# EAGLE design Adapter Light (EAGLE 9.6.1)

## Sheet 1 of 2
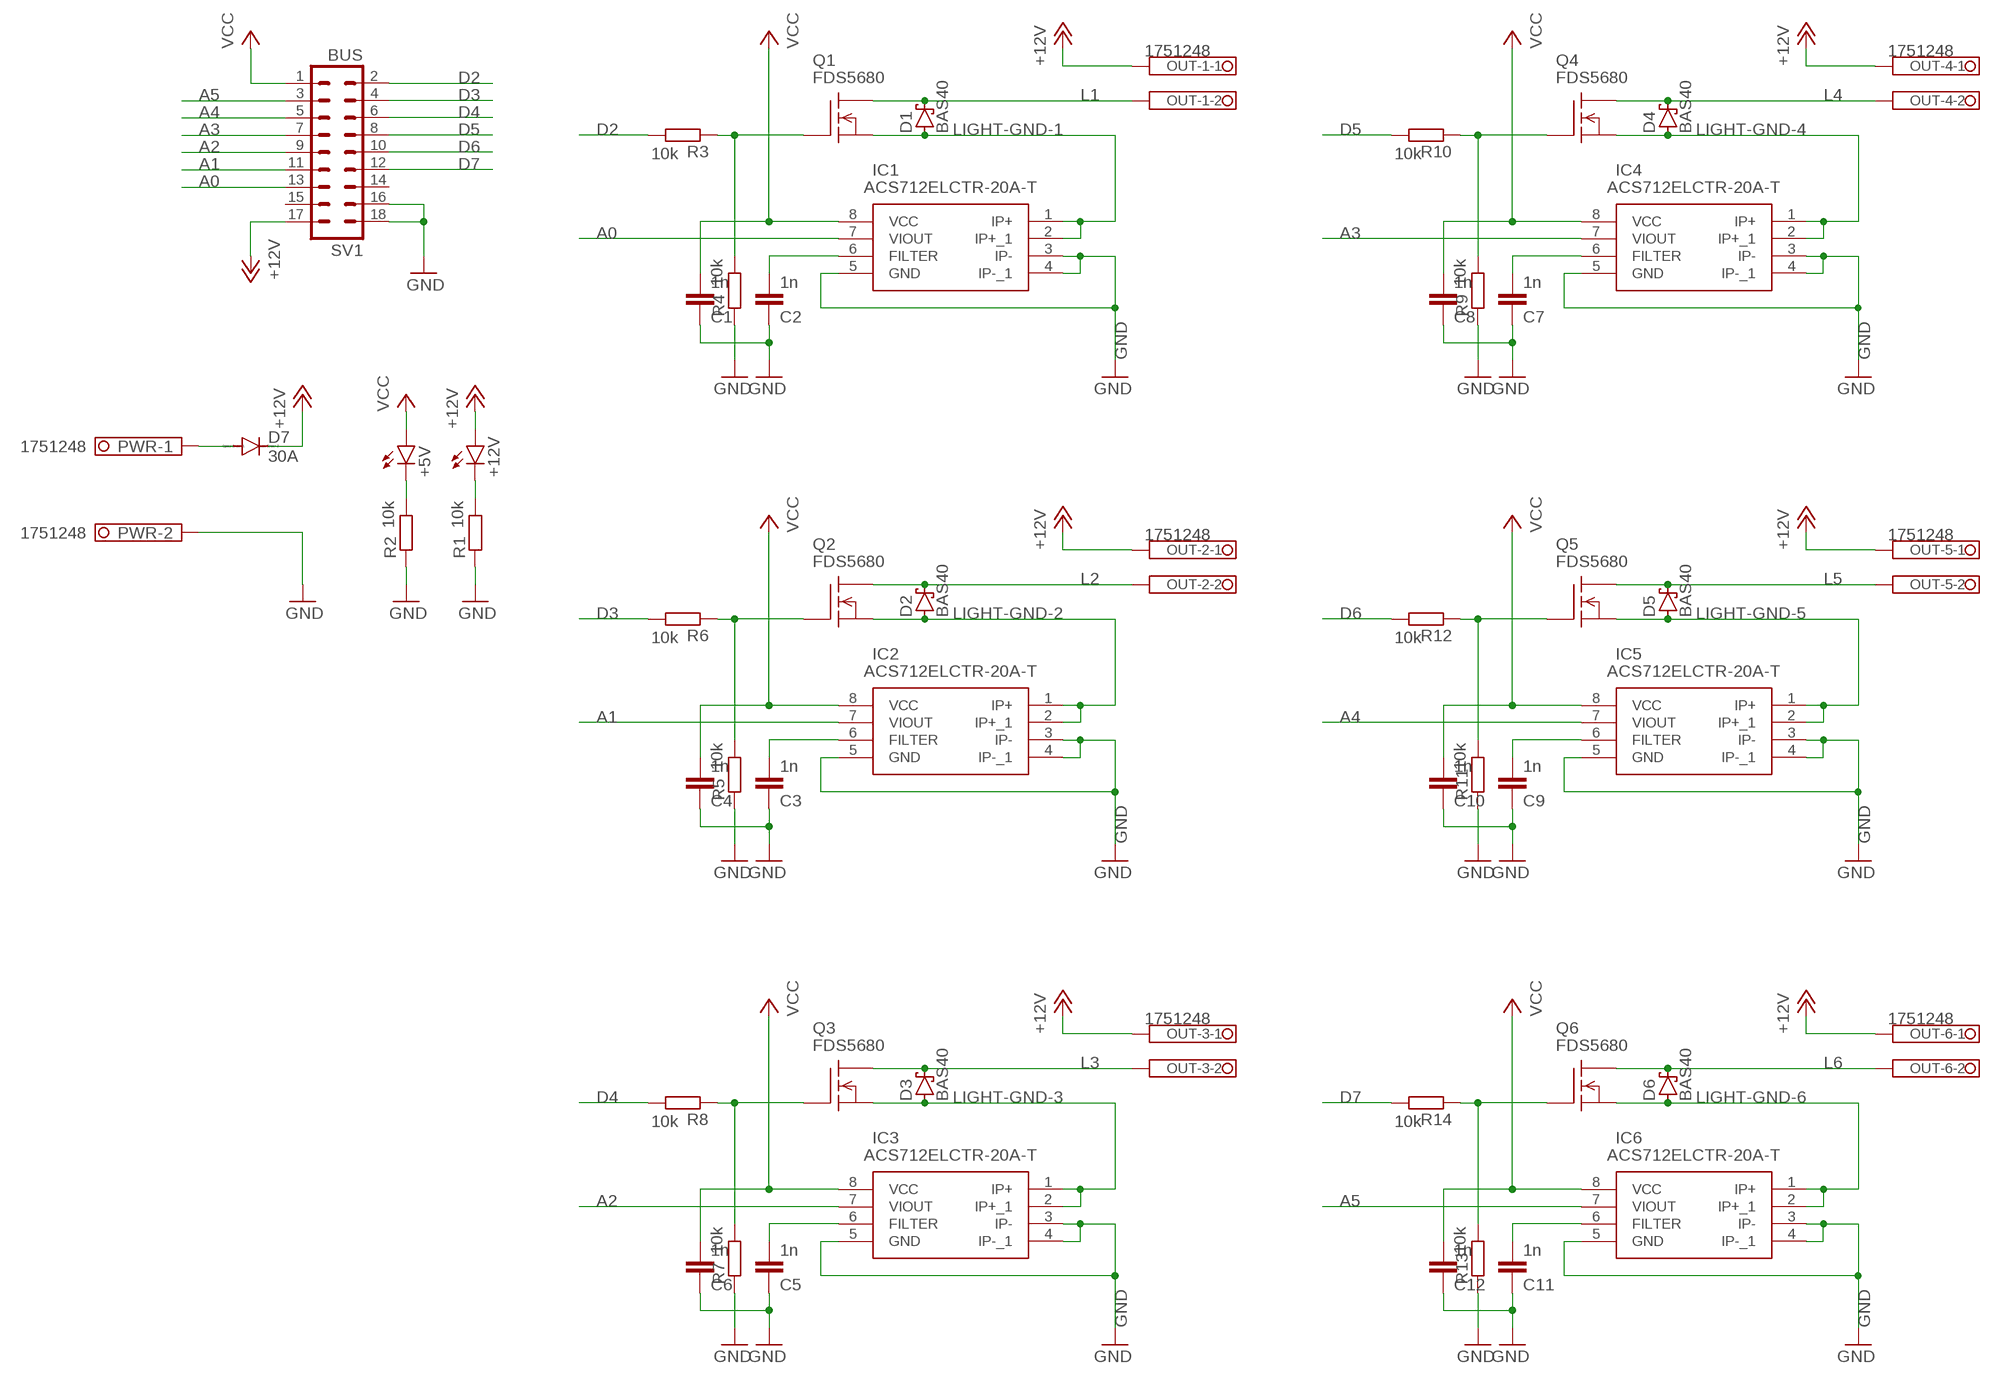
[diagram p0: schematic, sheet 1]

### Parts
+5V  LED3MM  [LED3MM]
+12V  LED3MM  [LED3MM]
C1  1n  C-EUC0402K  [C0402K]
C2  1n  C-EUC0402K  [C0402K]
C3  1n  C-EUC0402K  [C0402K]
C4  1n  C-EUC0402K  [C0402K]
C5  1n  C-EUC0402K  [C0402K]
C6  1n  C-EUC0402K  [C0402K]
C7  1n  C-EUC0402K  [C0402K]
C8  1n  C-EUC0402K  [C0402K]
C9  1n  C-EUC0402K  [C0402K]
C10  1n  C-EUC0402K  [C0402K]
C11  1n  C-EUC0402K  [C0402K]
C12  1n  C-EUC0402K  [C0402K]
D1  BAS40  [SOT23]
D2  BAS40  [SOT23]
D3  BAS40  [SOT23]
D4  BAS40  [SOT23]
D5  BAS40  [SOT23]
D6  BAS40  [SOT23]
D7  30A  DIODE-DO15-12  [DO15-12]
IC1  ACS712ELCTR-20A-T  [SOIC127P600X175-8N]
IC2  ACS712ELCTR-20A-T  [SOIC127P600X175-8N]
IC3  ACS712ELCTR-20A-T  [SOIC127P600X175-8N]
IC4  ACS712ELCTR-20A-T  [SOIC127P600X175-8N]
IC5  ACS712ELCTR-20A-T  [SOIC127P600X175-8N]
IC6  ACS712ELCTR-20A-T  [SOIC127P600X175-8N]
OUT-1  1751248  [1751248]
OUT-2  1751248  [1751248]
OUT-3  1751248  [1751248]
OUT-4  1751248  [1751248]
OUT-5  1751248  [1751248]
OUT-6  1751248  [1751248]
PWR  1751248  [1751248]
Q1  FDS5680  [SO-8]
Q2  FDS5680  [SO-8]
Q3  FDS5680  [SO-8]
Q4  FDS5680  [SO-8]
Q5  FDS5680  [SO-8]
Q6  FDS5680  [SO-8]
R1  10k  R-EU_MELF0102W  [MINI_MELF-0102W]
R2  10k  R-EU_MELF0102W  [MINI_MELF-0102W]
R3  10k  R-EU_MELF0102W  [MINI_MELF-0102W]
R4  10k  R-EU_MELF0102W  [MINI_MELF-0102W]
R5  10k  R-EU_MELF0102W  [MINI_MELF-0102W]
R6  10k  R-EU_MELF0102W  [MINI_MELF-0102W]
R7  10k  R-EU_MELF0102W  [MINI_MELF-0102W]
R8  10k  R-EU_MELF0102W  [MINI_MELF-0102W]
R9  10k  R-EU_MELF0102W  [MINI_MELF-0102W]
R10  10k  R-EU_MELF0102W  [MINI_MELF-0102W]
R11  10k  R-EU_MELF0102W  [MINI_MELF-0102W]
R12  10k  R-EU_MELF0102W  [MINI_MELF-0102W]
R13  10k  R-EU_MELF0102W  [MINI_MELF-0102W]
R14  10k  R-EU_MELF0102W  [MINI_MELF-0102W]
SV1  BUS  MA09-2  [MA09-2]

### Nets
+12V: +12V.A D7.C OUT-1.1 OUT-2.1 OUT-3.1 OUT-4.1 OUT-5.1 OUT-6.1 SV1.17
A0: IC1.7(VIOUT) SV1.13
A1: IC2.7(VIOUT) SV1.11
A2: IC3.7(VIOUT) SV1.9
A3: IC4.7(VIOUT) SV1.7
A4: IC5.7(VIOUT) SV1.5
A5: IC6.7(VIOUT) SV1.3
D2: R3.2 SV1.2
D3: R6.2 SV1.4
D4: R8.2 SV1.6
D5: R10.2 SV1.8
D6: R12.2 SV1.10
D7: R14.2 SV1.12
GND: C1.1 C2.1 C3.1 C4.1 C5.1 C6.1 C7.1 C8.1 C9.1 C10.1 C11.1 C12.1 IC1.3(IP-) IC1.4(IP-_1) IC1.5(GND) IC2.3(IP-) IC2.4(IP-_1) IC2.5(GND) IC3.3(IP-) IC3.4(IP-_1) IC3.5(GND) IC4.3(IP-) IC4.4(IP-_1) IC4.5(GND) IC5.3(IP-) IC5.4(IP-_1) IC5.5(GND) IC6.3(IP-) IC6.4(IP-_1) IC6.5(GND) PWR.2 R1.1 R2.1 R4.1 R5.1 R7.1 R9.1 R11.1 R13.1 SV1.16 SV1.18
L1: D1.3(C) OUT-1.2 Q1.5(D) Q1.6(D) Q1.7(D) Q1.8(D)
L2: D2.3(C) OUT-2.2 Q2.5(D) Q2.6(D) Q2.7(D) Q2.8(D)
L3: D3.3(C) OUT-3.2 Q3.5(D) Q3.6(D) Q3.7(D) Q3.8(D)
L4: D4.3(C) OUT-4.2 Q4.5(D) Q4.6(D) Q4.7(D) Q4.8(D)
L5: D5.3(C) OUT-5.2 Q5.5(D) Q5.6(D) Q5.7(D) Q5.8(D)
L6: D6.3(C) OUT-6.2 Q6.5(D) Q6.6(D) Q6.7(D) Q6.8(D)
LIGHT-GND-1: D1.1(A) IC1.1(IP+) IC1.2(IP+_1) Q1.1(S) Q1.2(S) Q1.3(S)
LIGHT-GND-2: D2.1(A) IC2.1(IP+) IC2.2(IP+_1) Q2.1(S) Q2.2(S) Q2.3(S)
LIGHT-GND-3: D3.1(A) IC3.1(IP+) IC3.2(IP+_1) Q3.1(S) Q3.2(S) Q3.3(S)
LIGHT-GND-4: D4.1(A) IC4.1(IP+) IC4.2(IP+_1) Q4.1(S) Q4.2(S) Q4.3(S)
LIGHT-GND-5: D5.1(A) IC5.1(IP+) IC5.2(IP+_1) Q5.1(S) Q5.2(S) Q5.3(S)
LIGHT-GND-6: D6.1(A) IC6.1(IP+) IC6.2(IP+_1) Q6.1(S) Q6.2(S) Q6.3(S)
N$1: C2.2 IC1.6(FILTER)
N$2: C3.2 IC2.6(FILTER)
N$3: Q2.4(G) R5.2 R6.1
N$4: C5.2 IC3.6(FILTER)
N$5: Q3.4(G) R7.2 R8.1
N$6: +12V.K(C) R1.2
N$7: C7.2 IC4.6(FILTER)
N$8: Q4.4(G) R9.2 R10.1
N$9: Q1.4(G) R3.1 R4.2
N$10: C9.2 IC5.6(FILTER)
N$11: Q5.4(G) R11.2 R12.1
N$12: +5V.K(C) R2.2
N$13: C11.2 IC6.6(FILTER)
N$14: Q6.4(G) R13.2 R14.1
N$15: D7.A PWR.1
VCC: +5V.A C1.2 C4.2 C6.2 C8.2 C10.2 C12.2 IC1.8(VCC) IC2.8(VCC) IC3.8(VCC) IC4.8(VCC) IC5.8(VCC) IC6.8(VCC) SV1.1
Unconnected: SV1.14 SV1.15

## Sheet 2 of 2

## Library data of the parts
+5V +12V = led:LED: LED OSRAM: - CHIPLED LG R971, LG N971, LY N971, LG Q971, LY Q971, LO R971, LY R971 LH N974, LH R974 LS Q976, LO Q976, LY Q976 LO Q996 - Hyper CHIPLED LW Q18S LB Q993, LB Q99A, LB R99A - SideLED LS A670, LO A670, LY A670, LG A670, LP A670 LB A673, LV A673, LT A673, LW A673 LH A674 LY A675 LS A676, LA A676, LO A676, LY A676, LW A676 LS A679, LY A679, LG A679 - Hyper Micro SIDELED® LS Y876, LA Y876, LO Y876, LY Y876 LT Y87S - SmartLED LW L88C, LW L88S LB L89C, LB L89S, LG L890 LS L89K, LO L89K, LY L89K LS L896, LA L896, LO L896, LY L896 - TOPLED LS T670, LO T670, LY T670, LG T670, LP T670 LSG T670, LSP T670, LSY T670, LOP T670, LYG T670 LG T671, LOG T671, LSG T671 LB T673, LV T673, LT T673, LW T673 LH T674 LS T676, LA T676, LO T676, LY T676, LB T676, LH T676, LSB T676, LW T676 LB T67C, LV T67C, LT T67C, LS T67K, LO T67K, LY T67K, LW E67C LS E67B, LA E67B, LO E67B, LY E67B, LB E67C, LV E67C, LT E67C LW T67C LS T679, LY T679, LG T679 LS T770, LO T770, LY T770, LG T770, LP T770 LB T773, LV T773, LT T773, LW T773 LH T774 LS E675, LA E675, LY E675, LS T675 LS T776, LA T776, LO T776, LY T776, LB T776 LHGB T686 LT T68C, LB T68C - Hyper Mini TOPLED® LB M676 - Mini TOPLED Santana® LG M470 LS M47K, LO M47K, LY M47K Source: http://www.osram.convergy.de LUXEON: - LUMILED® LXK2-PW12-R00, LXK2-PW12-S00, LXK2-PW14-U00, LXK2-PW14-V00 LXK2-PM12-R00, LXK2-PM12-S00, LXK2-PM14-U00 LXK2-PE12-Q00, LXK2-PE12-R00, LXK2-PE12-S00, LXK2-PE14-T00, LXK2-PE14-U00 LXK2-PB12-K00, LXK2-PB12-L00, LXK2-PB12-M00, LXK2-PB14-N00, LXK2-PB14-P00, LXK2-PB14-Q00 LXK2-PR12-L00, LXK2-PR12-M00, LXK2-PR14-Q00, LXK2-PR14-R00 LXK2-PD12-Q00, LXK2-PD12-R00, LXK2-PD12-S00 LXK2-PH12-R00, LXK2-PH12-S00 LXK2-PL12-P00, LXK2-PL12-Q00, LXK2-PL12-R00 Source: www.luxeon.com KINGBRIGHT: KA-3528ASYC Source: www.kingbright.com
C1-C12 = rcl:C-EU: CAPACITOR, European symbol; SPICEPREFIX: C
D1-D6 = diode:BAS40: Silicon Schottky Diodes General-purpose diode for high-speed switching
D7 = diode:DIODE-: DIODE
IC1-IC6 = SamacSys_Parts:ACS712ELCTR-20A-T: ACS712ELCTR-20A-T, Hall Effect Sensor 5V 8-Pin SOIC, SOIC N Source: Datasheet <http://uk.rs-online.com/web/p/products/6807135P>; ALLIED_NUMBER: R1076682; DESCRIPTION: ACS712ELCTR-20A-T, Hall Effect Sensor 5V 8-Pin SOIC, SOIC N; HEIGHT: 1.75mm; MANUFACTURER_NAME: Allegro Microsystems; MANUFACTURER_PART_NUMBER: ACS712ELCTR-20A-T; RS_PART_NUMBER: 6807135P; RS_PRICE-STOCK: http://uk.rs-online.com/web/p/products/6807135P
OUT-1-OUT-6 PWR = con-phoenix-350:1751248: MKDS 1/ 2-3,5 Printklemme Nennstrom: 10 A Bemessungsspannung: 160 V Raster: 3,5 mm Polzahl: 2 Montageart: Löten Anschlussart: Schraubanschluss Anschlussrichtung vom Leiter zur Platine: 0° Source: http://eshop.phoenixcontact.com .. 1751248.pdf; OC_FARNELL: unknown; OC_NEWARK: unknown
Q1-Q6 = transistor-fet:FDS5680: 60V N-Channel PowerTrench TM MOSFET FAIRCHILD FDS5680.pdf
R1-R14 = rcl:R-EU_: RESISTOR, European symbol; SPICEPREFIX: R
SV1 = con-lstb:MA09-2: PIN HEADER; OC_FARNELL: unknown; OC_NEWARK: unknown

## Board
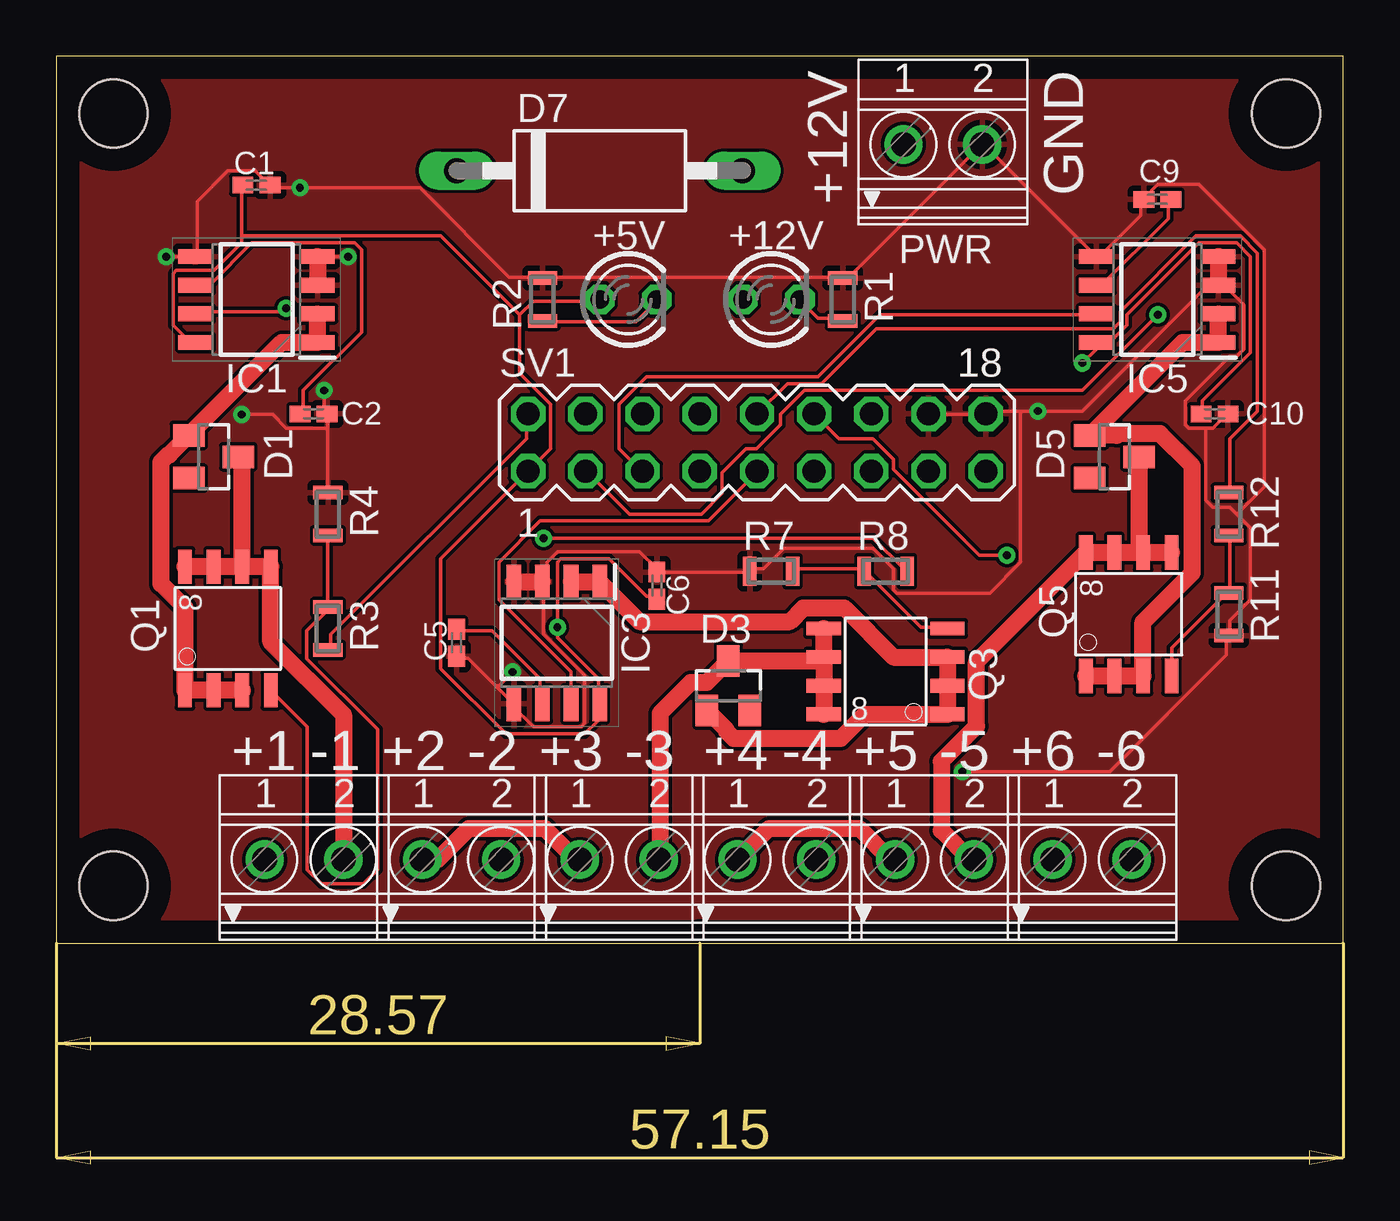
[diagram p1: board, top side]
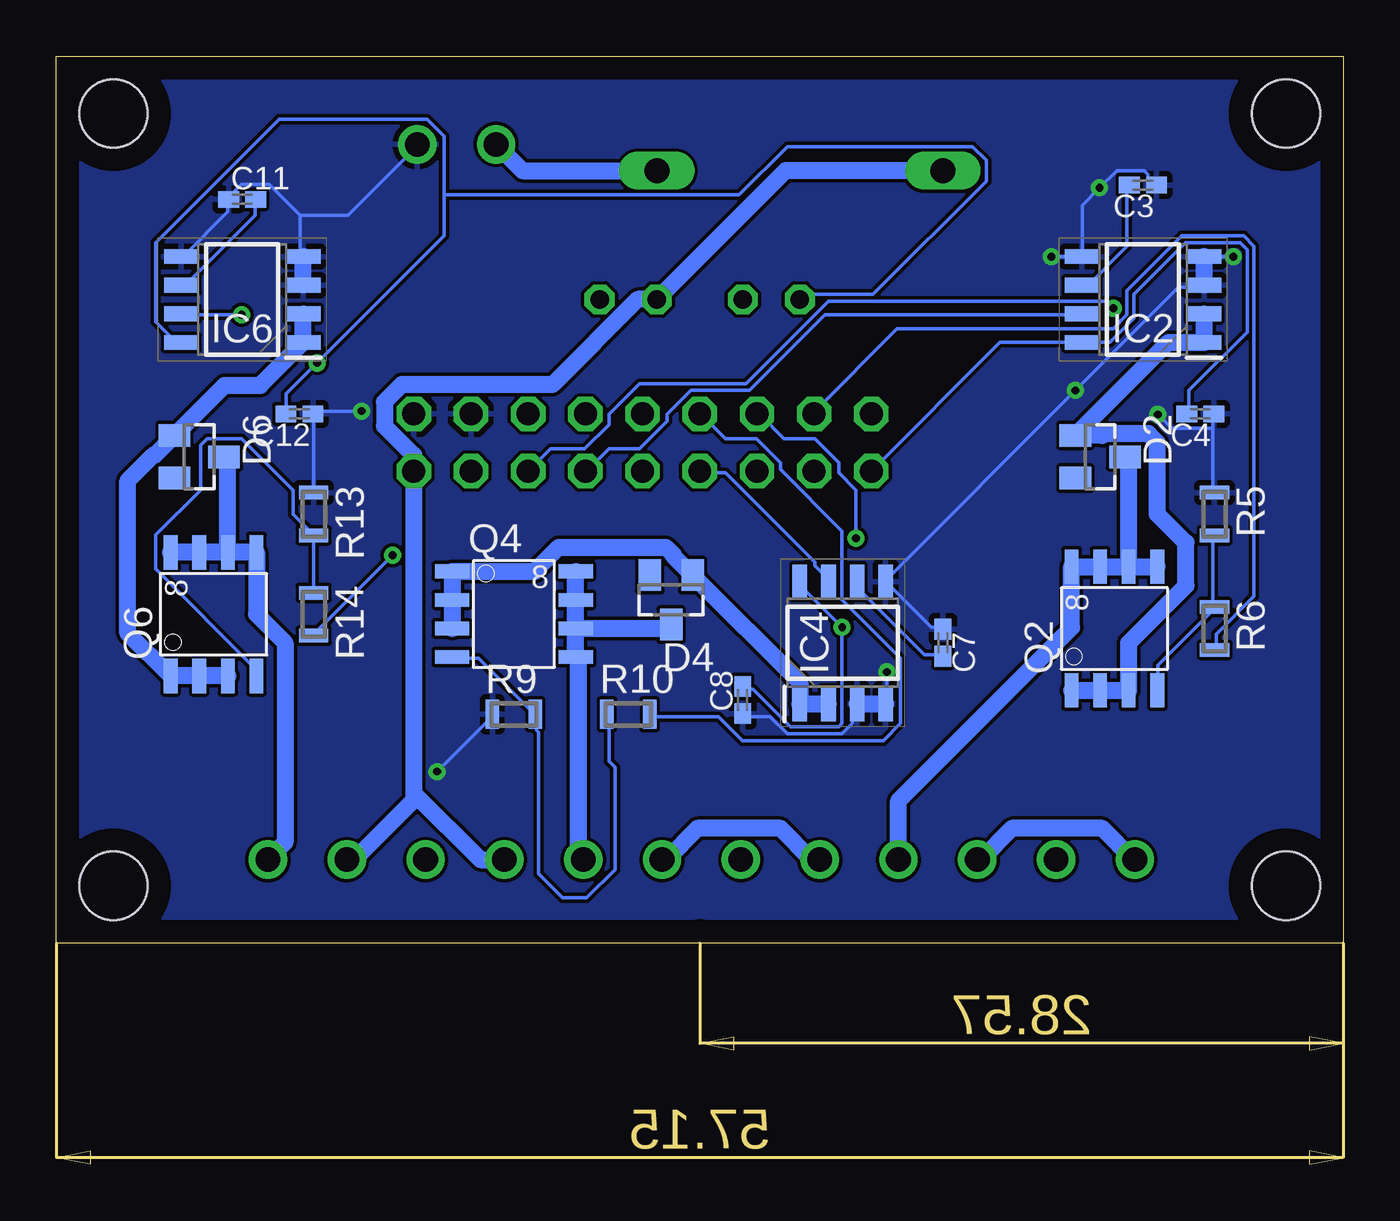
[diagram p2: board, bottom side, seen from below]

Size 57.15 x 39.37 mm. Coordinates in mm from the lower left corner, seen from the top.
Outline: 0,0 57.15,0 57.15,39.37 0,39.37 0,0
Copper layers (1*16): Top 0.035mm / dielectric 1.5mm / Bottom 0.035mm
Design rules "default": minimum track width 6mil, minimum drill 0.35mm, track to track 6mil, track to pad 6mil, pad to pad 6mil, via to via 6mil, smd to smd 6mil, copper to edge 40mil, drill to drill 6mil, minimum pad ring 10mil, minimum via ring 8mil, stop-mask expansion 4mil, vias tented up to drill 0mil, thermal gap 10mil
Holes 3.05 mm at 2.54,2.54 54.61,2.54 54.61,36.83 2.54,36.83

### Footprints (pad centres in the part's own frame; a part is rotated, then mirrored left to right if it is on the bottom)
LED3MM = drill 0.813 octagon: A -1.27,0; K 1.27,0
C0402K = smd 0.925 x 0.74: 1 -0.6,0; 2 0.6,0
SOT23 = smd 1 x 1.4: 1 -0.95,-1.1; 2 0.95,-1.1; 3 0,1.1
DO15-12 = drill 1.118 long: A 6.35,0; C -6.35,0
SOIC127P600X175-8N = smd 1.525 x 0.65: 1 -2.712,1.905; 2 -2.712,0.635; 3 -2.712,-0.635; 4 -2.712,-1.905; 5 2.712,-1.905; 6 2.712,-0.635; 7 2.712,0.635; 8 2.712,1.905
1751248 = drill 1.1 pad 1.7: 1 -1.75,-0.1; 2 1.75,-0.1
SO-8 = smd 1.524 x 0.61: 1 -2.743,1.905; 2 -2.743,0.635; 3 -2.743,-0.635; 4 -2.743,-1.905; 5 2.743,-1.905; 6 2.743,-0.635; 7 2.743,0.635; 8 2.743,1.905
MINI_MELF-0102W = smd 0.6 x 1.3: 1 -0.95,0; 2 0.95,0
MA09-2 = drill 1.016 octagon: 1 -10.16,-1.27; 2 -10.16,1.27; 3 -7.62,-1.27; 4 -7.62,1.27; 5 -5.08,-1.27; 6 -5.08,1.27; 7 -2.54,-1.27; 8 -2.54,1.27; 9 0,-1.27; 10 0,1.27; 11 2.54,-1.27; 12 2.54,1.27; 13 5.08,-1.27; 14 5.08,1.27; 15 7.62,-1.27; 16 7.62,1.27; 17 10.16,-1.27; 18 10.16,1.27

### Placement (x,y rotation side)
+5V  25.4,28.57 0 top
+12V  31.75,28.57 0 top
C1  8.89,33.66 180 top
C2  11.43,23.5 180 top
C3  8.89,33.66 180 bottom
C4  6.35,23.5 180 bottom
C5  17.78,13.34 90 top
C6  26.67,15.88 270 top
C7  17.78,13.34 270 bottom
C8  26.67,10.79 90 bottom
C9  48.9,33.02 0 top
C10  51.44,23.5 180 top
C11  48.9,33.02 0 bottom
C12  46.35,23.5 180 bottom
D1  6.99,21.59 270 top
D2  10.79,21.59 270 bottom
D3  29.84,11.43 0 top
D4  29.84,15.24 180 bottom
D5  46.99,21.59 270 top
D6  50.8,21.59 270 bottom
D7  24.13,34.29 0 top
IC1  8.89,28.57 180 top
IC2  8.89,28.57 180 bottom
IC3  22.23,13.34 270 top
IC4  22.23,13.34 90 bottom
IC5  48.9,28.57 180 top
IC6  48.9,28.57 180 bottom
OUT-1  11,3.81 0 top
OUT-2  18,3.81 0 top
OUT-3  25,3.81 0 top
OUT-4  32,3.81 0 top
OUT-5  39,3.81 0 top
OUT-6  46,3.81 0 top
PWR  39.37,35.56 0 top
Q1  7.62,13.97 90 top
Q2  10.16,13.97 90 bottom
Q3  36.83,12.06 180 top
Q4  36.83,14.61 0 bottom
Q5  47.62,14.61 90 top
Q6  50.16,14.61 90 bottom
R1  34.92,28.57 270 top
R2  21.59,28.57 270 top
R3  12.06,13.97 270 top
R4  12.06,19.05 270 top
R5  5.71,19.05 270 bottom
R6  5.71,13.97 270 bottom
R7  31.75,16.51 0 top
R8  36.83,16.51 0 top
R9  36.83,10.16 0 bottom
R10  31.75,10.16 0 bottom
R11  52.07,14.61 90 top
R12  52.07,19.05 90 top
R13  45.72,19.05 270 bottom
R14  45.72,14.61 270 bottom
SV1  31.11,22.23 0 top

### Tracks (layer width: path | path; a pad name or v marks a point on that pad's centre or on a via)
+12V
  Top 0.762: OUT-2.1 16.94,3.71 18.32,5.09 21.69,5.09 23.07,3.71 OUT-3.1 | OUT-4.1 30.27,3.71 31.66,5.09 35.66,5.09 37.04,3.71 OUT-5.1
  Bottom 0.762: 41.27,6.67 41.27,6.35 43.91,3.71 OUT-6.1 | 41.27,6.67 41.27,7.3 SV1.17 41.27,21.66 42.57,22.96 42.57,24.03 41.81,24.79 35.12,24.79 31.33,28.57 +12V.A 24.77,34.29 D7.C | 41.27,6.67 38.32,3.71 OUT-5.1 | OUT-1.1 9.32,3.71 10.7,5.09 14.71,5.09 16.09,3.71 OUT-2.1 | OUT-3.1 23.61,3.71 24.99,5.09 28.68,5.09 30.06,3.71 OUT-4.1
A0  (via drill 0.35)
  Top 0.152: v10.21,28.19 10.06,28.04 6.25,28.04 IC1.7
  Bottom 0.152: v10.21,28.19 10.52,28.5 22.86,28.5 26.52,24.84 31.24,24.84 32.61,23.47 32.61,23.01 33.68,21.95 35.2,21.95 SV1.13
A1
  Bottom 0.152: IC2.7 11.73,27.89 23.01,27.89 26.36,24.54 28.96,24.54 30.02,23.47 30.02,23.16 31.24,21.95 32.61,21.95 33.53,21.03 SV1.11
A2
  Top 0.152: IC3.7 22.86,12.04 19.66,15.24 19.66,16.92 21.49,18.75 28.96,18.75 31.09,20.88 SV1.9
A3
  Bottom 0.152: IC4.7 22.86,16.15 23.47,16.76 23.47,16.92 27.43,20.88 28.5,20.88 SV1.7
A4
  Top 0.152: IC5.7 46.18,27.89 36.58,27.89 33.83,25.15 26.21,25.15 24.99,23.93 24.99,21.95 25.91,21.03 SV1.5
A5  (via drill 0.35)
  Top 0.152: v48.92,27.89 45.57,24.54 33.22,24.54 32.16,23.47 32.16,23.01 31.09,21.95 30.63,21.95 29.57,20.88 29.57,19.96 28.65,19.05 25.45,19.05 23.62,20.88 SV1.3
  Bottom 0.152: v48.92,27.89 51.51,27.89 IC6.7
D2
  Top 0.152: R3.2 12.19,13.11 12.19,13.72 20.88,22.4 20.88,23.47 SV1.2
D3
  Bottom 0.152: R6.2 5.64,13.11 5.64,13.72 3.96,15.39 3.96,30.94 4.42,31.39 7.16,31.39 9.6,28.96 9.6,27.89 10.21,27.28 19.81,27.28 23.47,23.62 SV1.4
D4  (via drill 0.35)
  Top 0.152: v21.64,17.98 36.27,17.98 37.64,16.61 R8.2
  Bottom 0.152: v21.64,17.98 21.64,20.12 22.4,20.88 22.4,21.34 23.47,22.4 24.84,22.4 25.91,23.47 SV1.6
D5
  Bottom 0.152: R10.2 30.79,10.06 27.74,10.06 26.67,8.99 20.42,8.99 19.66,9.75 19.66,12.65 22.25,15.24 22.25,18.29 24.99,21.03 24.99,21.34 26.06,22.4 27.43,22.4 28.5,23.47 SV1.8
D6
  Top 0.152: SV1.10 32.46,24.84 33.98,24.84 36.42,27.28 46.94,27.28 47.24,27.58 47.24,28.04 50.6,31.39 52.58,31.39 53.34,30.63 53.34,23.62 52.12,22.4 52.12,20.12 R12.2
D7  (via drill 0.35)
  Top 0.152: v42.22,17.22 41,17.22 37.19,21.03 37.19,21.49 36.27,22.4 34.75,22.4 SV1.12
  Bottom 0.152: v42.22,17.22 45.72,13.72 R14.2
GND  (via drill 0.35)
  Top 0.152: v40.23,7.62 46.79,7.62 51.97,12.8 51.97,13.56 R11.1 52.12,13.72 52.12,14.33 53.03,15.24 53.03,18.44 52.43,19.05 | 19.51,11.43 20.27,10.67 IC4.4 20.27,10.52 21.18,9.6 23.32,9.6 23.47,9.75 23.47,11.89 21.64,13.72 21.64,15.7 IC3.3 21.79,16.31 21.79,16.92 22.25,17.37 25.91,17.37 26.67,16.61 C6.1 26.67,16.46 30.79,16.46 R7.1 30.94,16.61 31.39,16.61 32.31,17.53 36.27,17.53 37.19,16.61 37.19,15.7 37.34,15.54 41.45,15.54 42.82,16.92 42.82,23.62 | 19.51,11.43 18.29,12.65 17.83,12.65 C5.1 | v20.27,12.04 19.66,11.43 19.51,11.43 | 51.05,22.86 50.29,22.86 50.14,23.01 50.14,24.08 52.12,26.06 52.43,26.06 52.73,26.36 52.73,28.35 51.97,29.11 IC5.3 51.36,28.96 50.9,28.96 45.57,23.62 v43.59,23.62 42.82,23.62 | 51.05,22.86 51.36,22.86 51.97,23.47 C10.1 | 42.82,23.62 41.3,23.62 SV1.18 41.15,23.47 38.86,23.47 SV1.16 | 52.43,19.05 52.12,19.36 51.36,19.36 51.05,19.66 51.05,22.86 | 12.04,22.86 12.04,20.12 R4.1 | 12.04,22.86 12.04,23.47 C2.1 11.89,23.62 v11.89,24.54 | v8.23,23.47 9.6,23.47 10.21,22.86 12.04,22.86 | v12.95,30.48 IC2.5 | v4.88,30.48 IC2.4 6.25,30.48 6.25,32.92 7.62,34.29 8.84,34.29 9.45,33.68 C1.1 9.6,33.53 v10.82,33.53 16.15,33.53 20.12,29.57 21.49,29.57 R2.1 21.64,29.57 34.9,29.57 R1.1 35.05,29.41 41,35.36 PWR.2 41.15,35.51 IC6.4 46.33,30.48 48.16,32.31 48.16,32.92 C9.1 48.31,33.07 48.92,33.68 50.75,33.68 53.65,30.79 53.65,20.27 52.43,19.05
  Top 0.762: IC2.5 IC1.3 | IC6.5 IC5.3 | IC4.5 IC3.3
  Bottom 0.152: v40.23,7.62 37.8,10.06 R9.1 | C8.1 26.67,10.06 25.45,10.06 24.69,9.3 22.25,9.3 21.79,9.75 21.79,10.36 IC4.3 | v20.27,12.04 20.27,10.97 IC4.4 | R13.1 45.72,23.47 C12.1 45.72,23.62 v43.59,23.62 | 5.79,22.86 5.79,20.12 R5.1 | 5.79,22.86 5.79,23.47 C4.1 | 5.79,22.86 7.62,22.86 v8.23,23.47 | C7.1 17.83,14.02 18.29,14.02 20.27,16 IC4.5 20.27,16.15 v11.89,24.54 7.32,29.11 6.55,29.11 IC2.3 | IC6.5 51.51,30.48 49.53,32.46 49.53,32.92 C11.1 49.53,33.07 48.92,33.68 47.7,33.68 46.33,32.31 | 46.33,32.31 46.33,30.79 IC6.4 | 46.33,32.31 44.2,32.31 41.15,35.36 PWR.2 | C3.1 8.38,33.68 8.69,33.98 8.69,34.14 8.84,34.29 10.06,34.29 v10.82,33.53 11.58,32.77 11.58,30.48 IC2.5 v12.95,30.48 | v4.88,30.48 IC2.4
  Bottom 0.762: IC2.3 IC2.4 | IC4.3 IC4.4 | IC6.3 IC6.4
  pour Bottom: 0,39.37 57.15,39.37 57.15,0 0,0
  pour Top: 0,39.37 57.15,39.37 57.15,0 0,0
L1
  Top 0.762: OUT-1.2 12.75,10.14 9.53,13.37 Q1.5 Q1.6 | Q1.6 Q1.7 Q1.8 | Q1.6 8.26,21.42 D1.3
L2
  Bottom 0.762: OUT-2.2 19.75,6.32 12.06,14.01 Q2.8 Q2.7 Q2.6 | Q2.6 Q2.5 | Q2.6 9.53,21.42 D2.3
L3
  Top 0.762: OUT-3.2 26.81,3.77 26.81,10.2 28.17,11.56 28.88,11.56 D3.3 33.92,12.53 Q3.6 | Q3.6 Q3.5 | Q3.6 Q3.7 Q3.8
L4
  Bottom 0.762: OUT-4.2 33.97,3.7 33.97,12.59 Q4.5 Q4.6 | Q4.6 Q4.7 Q4.8 | Q4.6 30.02,13.97 D4.3
L5
  Top 0.762: Q5.6 Q5.7 Q5.8 40.87,12.5 40.87,9.63 39.3,8.07 39.3,5 40.59,3.71 OUT-5.2 | Q5.6 Q5.5 | Q5.6 48.09,17.52 D5.3
L6
  Bottom 0.762: Q6.6 Q6.5 48.26,14.61 46.99,13.34 46.99,4.47 OUT-6.2 | Q6.6 Q6.7 Q6.8 | Q6.6 49.53,21.42 D6.3
LIGHT-GND-1
  Top 0.762: Q1.3 Q1.2 Q1.1 5.71,14.89 4.65,15.96 4.65,21.36 4.96,21.67 5.02,21.67 D1.1 10.02,26.67 IC1.1 IC1.2
LIGHT-GND-2
  Bottom 0.762: Q2.1 Q2.2 Q2.3 9.53,13.34 6.99,15.88 6.99,17.78 8.26,19.05 8.26,22.23 8.65,22.62 10.62,22.62 10.7,22.54 D2.1 7.76,26.67 IC2.1 IC2.2
LIGHT-GND-3
  Top 0.762: D3.1 29.76,9.46 29.76,9.41 30.07,9.1 34.84,9.1 35.91,10.16 Q3.1 Q3.2 Q3.3 37.18,12.7 34.99,14.88 33.18,14.88 32.58,14.28 25.9,14.28 IC3.1 IC3.2
LIGHT-GND-4
  Bottom 0.762: Q4.3 Q4.2 Q4.1 35.91,16.51 34.84,17.57 30.07,17.57 29.76,17.26 29.76,17.21 D4.1 24.13,11.57 IC4.1 IC4.2
LIGHT-GND-5
  Top 0.762: Q5.1 Q5.2 Q5.3 48.26,14.26 50.44,16.44 50.44,21.19 49.01,22.62 47.17,22.62 47.09,22.54 D5.1 50.02,26.67 IC5.1 IC5.2
LIGHT-GND-6
  Bottom 0.762: Q6.3 Q6.2 Q6.1 53.98,13.77 53.98,20.52 52.82,21.67 52.77,21.67 D6.1 49.67,24.77 48.09,24.77 IC6.1 IC6.2
N$1
  Top 0.152: C2.2 10.97,23.62 10.97,24.54 13.56,27.13 13.56,30.79 13.26,31.09 8.69,31.09 6.86,29.26 6.25,29.26 IC1.6
N$2
  Bottom 0.152: C3.2 9.6,33.53 9.6,30.94 11.28,29.26 11.58,29.26 IC2.6
N$3
  Bottom 0.152: R5.2 5.79,17.98 5.79,14.94 R6.1 5.79,14.78 8.23,12.34 8.23,11.28 Q2.4
N$4
  Top 0.152: C5.2 17.83,13.87 19.36,13.87 21.49,11.73 21.49,10.67 IC3.6
N$5
  Top 0.152: R7.2 32.77,16.61 35.81,16.61 R8.1 35.97,16.46 38.41,14.02 39.47,14.02 Q3.4
N$6
  Top 0.152: R1.2 34.9,27.74 33.83,27.74 33.07,28.5 +12V.K
N$7
  Bottom 0.152: C7.2 17.83,12.8 18.59,12.8 21.49,15.7 21.49,16 IC4.6
N$8
  Bottom 0.152: R10.1 32.61,10.06 32.61,8.08 32.35,7.81 32.35,3.25 33.59,2.01 34.67,2.01 35.74,3.07 35.74,9.37 35.81,9.45 35.81,10.06 R9.2 35.97,10.21 38.41,12.65 39.47,12.65 Q4.4
N$9
  Top 0.152: R4.2 12.04,17.98 12.04,14.94 R3.1 12.04,14.78 11.12,13.87 11.12,12.63 14.26,9.49 14.26,3.26 13.63,2.63 11.78,2.63 11.15,3.26 11.15,9.6 Q1.4
N$10
  Top 0.152: C9.2 49.38,32.92 49.38,32.16 46.33,29.11 IC5.6
N$11
  Top 0.152: R12.1 52.12,17.98 52.12,15.7 R11.2 51.97,15.54 49.53,13.11 Q5.4
N$12
  Top 0.152: R2.2 21.64,27.58 25.76,27.58 26.67,28.5 +5V.K
N$13
  Bottom 0.152: C11.2 48.31,32.92 48.31,32.31 51.51,29.11 IC6.6
N$14
  Bottom 0.152: R14.1 R13.2 45.72,18.14 46.63,19.05 46.63,20.12 48.92,22.4 50.44,22.4 50.75,22.1 50.75,20.12 52.73,18.14 52.73,16.61 48.31,12.19 48.31,11.89 Q6.4
N$15
  Bottom 0.762: PWR.1 36.45,34.29 D7.A
VCC  (via drill 0.35)
  Top 0.152: 8.23,31.39 8.23,31.09 7.01,29.87 5.33,29.87 5.18,29.72 5.18,27.43 5.94,26.67 IC1.8 | 8.23,31.39 8.23,33.53 C1.2 | 20.57,27.89 21.18,28.5 24.08,28.5 +5V.A | 20.57,27.89 20.57,25.3 21.95,23.93 21.95,21.95 SV1.1 17.07,17.07 17.07,12.19 19.96,9.3 23.47,9.3 24.08,9.91 24.08,10.52 IC3.8 24.08,10.67 24.08,11.73 22.25,13.56 v22.25,14.02 22.25,16.92 22.4,17.07 24.54,17.07 26.21,15.39 26.67,15.39 C6.2 | 8.23,31.39 17.07,31.39 20.57,27.89 | C10.2 50.9,23.62 50.9,24.08 53.03,26.21 53.03,30.48 52.43,31.09 50.75,31.09 47.55,27.89 47.55,27.43 46.79,26.67 IC5.8 46.18,26.36 v45.57,25.76
  Bottom 0.152: C4.2 6.86,23.62 6.86,24.54 4.27,27.13 4.27,30.79 4.57,31.09 7.01,31.09 9.3,28.8 9.3,27.74 10.36,26.67 IC2.8 15.24,26.67 SV1.1 | C8.2 26.67,11.28 26.21,11.28 24.54,9.6 22.4,9.6 22.25,9.75 v22.25,14.02 24.23,16 IC4.8 | 39.93,33.22 39.93,35.81 40.69,36.58 47.24,36.58 52.73,31.09 52.73,27.58 51.82,26.67 IC6.8 | 39.93,33.22 39.93,31.39 v45.57,25.76 46.94,24.38 46.94,23.62 C12.2 | 39.93,33.22 26.82,33.22 24.69,35.36 16.46,35.36 15.85,34.75 15.85,33.83 20.88,28.8 23.93,28.8 24.08,28.65 +5V.A

### Text on the board
tNames: +12V | GND | +1 | -1 | +2 | -2 | +3 | -3 | +4 | -4 | +5 | -5 | +6 | -6